# EAGLE design DCDC (EAGLE 7.5.0)
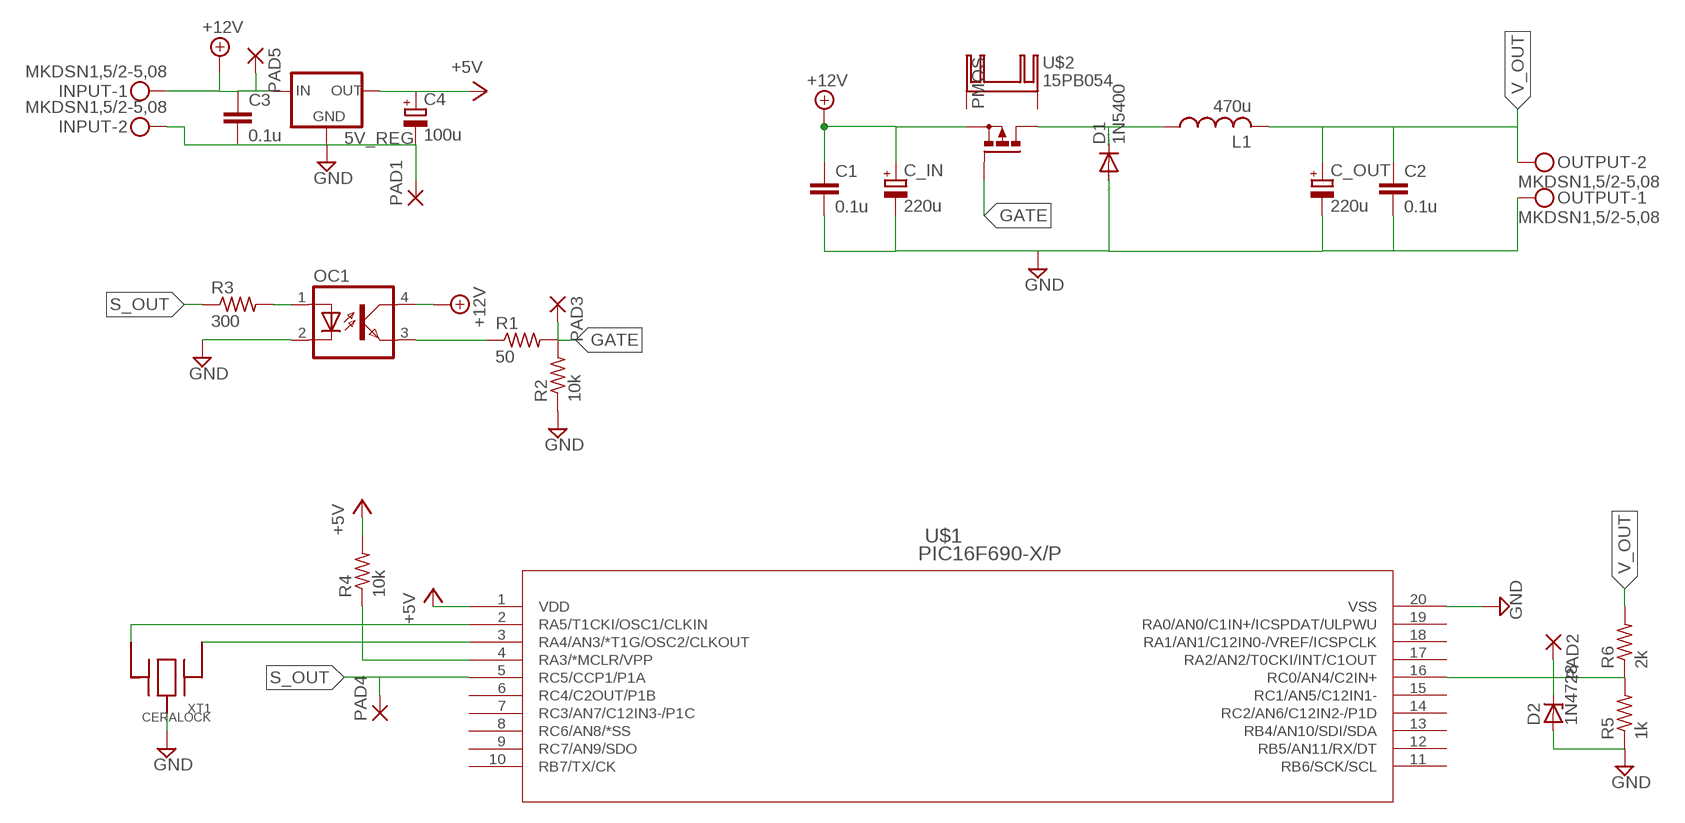
[diagram p0: schematic, sheet 1]

## Parts
5V_REG  78XXS  [78XXS]
C1  0.1u  C-EU050-024X044  [C050-024X044]
C2  0.1u  C-EU050-024X044  [C050-024X044]
C3  0.1u  C-EU050-024X044  [C050-024X044]
C4  100u  CPOL-EUE2,5-6E  [E2,5-6E]
C_IN  220u  CPOL-EUE3.5-8  [E3,5-8]
C_OUT  220u  CPOL-EUE3.5-8  [E3,5-8]
D1  1N5400  [DO201-15]
D2  1N4728  [DO41Z10]
INPUT  MKDSN1,5/2-5,08  [MKDSN1,5/2-5,08]
L1  470u  L-US  [TCV-471M-9A-8026]
OC1  PC817  [DIL04]
OUTPUT  MKDSN1,5/2-5,08  [MKDSN1,5/2-5,08]
PAD1  2,54/0,8  [2,54/0,8]
PAD2  2,54/0,8  [2,54/0,8]
PAD3  2,54/0,8  [2,54/0,8]
PAD4  2,54/0,8  [2,54/0,8]
PAD5  2,54/0,8  [2,54/0,8]
PMOS  PMOSFET_PTO220BV  [TO220BV]
R1  50  R-US_0207/7  [0207/7]
R2  10k  R-US_0207/7  [0207/7]
R3  300  R-US_0207/7  [0207/7]
R4  10k  R-US_0207/7  [0207/7]
R5  1k  R-US_0207/10  [0207/10]
R6  2k  R-US_0207/7  [0207/7]
U$1  PIC16F690-X/P  [PDIP20_300MC]
U$2  15PB054  [15PB054]
XT1  CERALOCK  [CERALOCK]

## Nets
+5V: 5V_REG.OUT C4.+ R4.2 U$1.1(VDD)
+12V: 5V_REG.IN C1.1 C3.1 C_IN.+ INPUT.1 OC1.4(COL) PAD5.1(P) PMOS.S
GATE: PAD3.1(P) PMOS.G R1.2 R2.2
GND: 5V_REG.GND C1.2 C2.2 C3.2 C4.- C_IN.- C_OUT.- D1.A D2.A INPUT.2 OC1.2(C) OUTPUT.1 PAD1.1(P) R2.1 R5.1 U$1.20(VSS) XT1.P$2
N$2: OC1.3(EMIT) R1.1
N$3: OC1.1(A) R3.2
N$4: U$1.2(RA5/T1CKI/OSC1/CLKIN) XT1.P$3
N$5: U$1.3(RA4/AN3/*T1G/OSC2/CLKOUT) XT1.P$1
N$6: R4.1 U$1.4(RA3/*MCLR/VPP)
N$7: D1.C L1.P$1 PMOS.D
S_OUT: PAD4.1(P) R3.1 U$1.5(RC5/CCP1/P1A)
V_IN: D2.C PAD2.1(P) R5.2 R6.1 U$1.16(RC0/AN4/C2IN+)
V_OUT: C2.1 C_OUT.+ L1.P$2 OUTPUT.2 R6.2
Unconnected: U$1.6(RC4/C2OUT/P1B) U$1.7(RC3/AN7/C12IN3-/P1C) U$1.8(RC6/AN8/*SS) U$1.9(RC7/AN9/SDO) U$1.10(RB7/TX/CK) U$1.11(RB6/SCK/SCL) U$1.12(RB5/AN11/RX/DT) U$1.13(RB4/AN10/SDI/SDA) U$1.14(RC2/AN6/C12IN2-/P1D) U$1.15(RC1/AN5/C12IN1-) U$1.17(RA2/AN2/T0CKI/INT/C1OUT) U$1.18(RA1/AN1/C12IN0-/VREF/ICSPCLK) U$1.19(RA0/AN0/C1IN+/ICSPDAT/ULPWU) U$2.P$1(K) U$2.P$2(K)

## Library data of the parts
5V_REG = v-reg:78XXS: VOLTAGE REGULATOR
C1-C3 = rcl:C-EU: CAPACITOR, European symbol
C4 C_IN C_OUT = rcl:CPOL-EU: POLARIZED CAPACITOR, European symbol
D1 = diode:1N5400: DIODE standard rectifier, 3 A, 50 V (Motorola)
D2 = diode:1N4728: Z DIODE 3.3 V, 1W, 5 percent
INPUT OUTPUT = con-phoenix-508:MKDSN1,5/2-5,08: MKDSN 1,5/ 2-5,08 Printklemme Nennstrom: 13,5 A Nennspannung: 250 V Rastermaß: 5,08 mm Polzahl: 2 Anschlussart: Schraubanschluss Montage: Löten Anschlussrichtung Leiter/Platine: 0 ° Artikelnummer: 1729128 Source: http://eshop.phoenixcontact.com .. 1729128.pdf
L1 = rcl:L-US: INDUCTOR, American symbol
OC1 = photocoupler:PC817: SHARP OPTO COUPLER
PAD1-PAD5 = wirepad:2,54/0,8: THROUGH-HOLE PAD
PMOS = transistor-power:PMOSFET_P: Power MOSFET P-Channel
R1-R6 = rcl:R-US_: RESISTOR, American symbol
U$1 = pic16f690_p:PIC16F690-X/P
U$2 = heatsink:15PB054
XT1 = serolock:CERALOCK

## Board
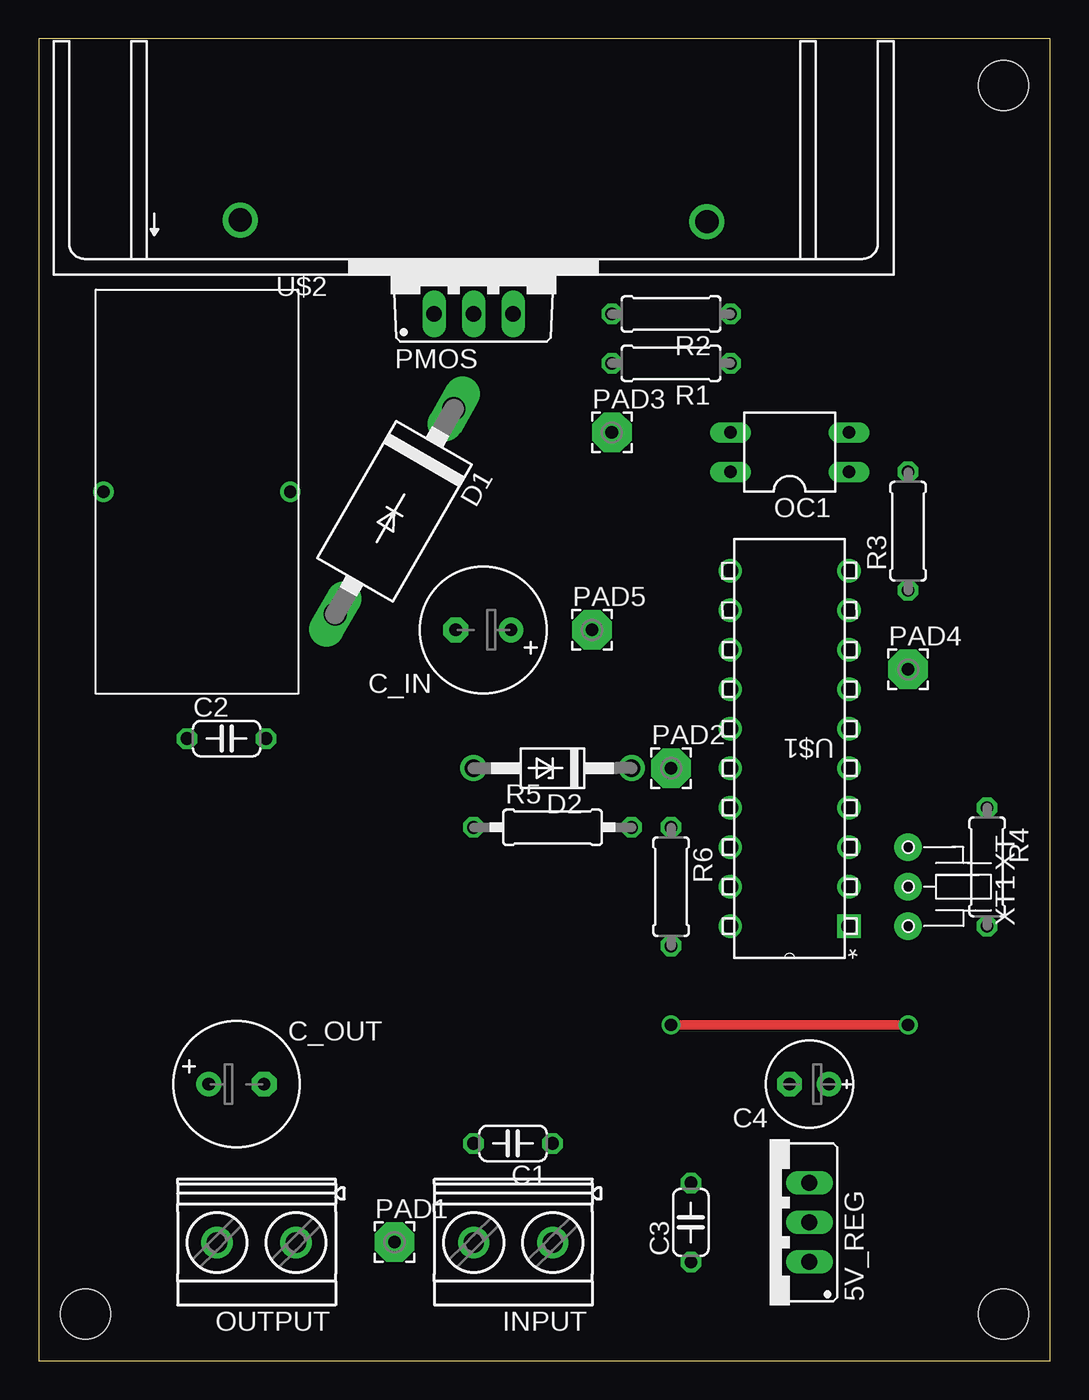
[diagram p1: board, top side]
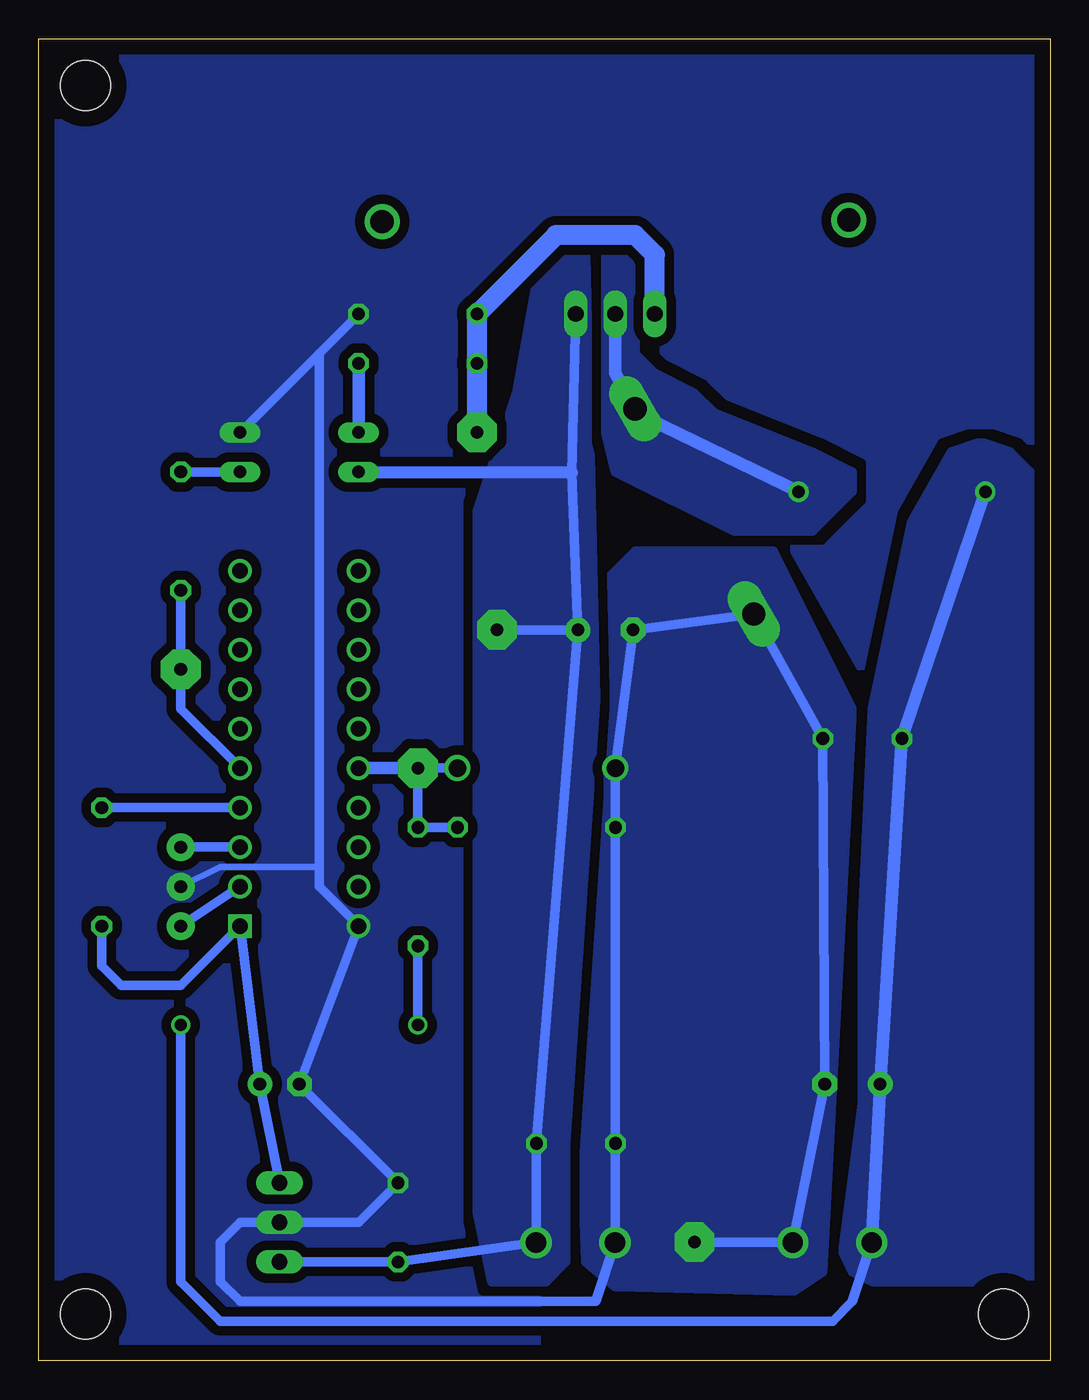
[diagram p2: board, bottom side, seen from below]

Size 65 x 85 mm. Coordinates in mm from the lower left corner, seen from the top.
Outline: 0,0 65,0 65,85 0,85 0,0
Copper layers (1*16): Top 0.035mm / dielectric 1.5mm / Bottom 0.035mm
Design rules "default": minimum track width 10mil, minimum drill 24mil, track to track 8mil, track to pad 8mil, pad to pad 8mil, via to via 8mil, smd to smd 8mil, copper to edge 40mil, drill to drill 8mil, minimum pad ring 10mil, minimum via ring 8mil, stop-mask expansion 4mil, vias tented up to drill 0mil, thermal gap 10mil
Holes 3.2 mm at 62,3 62,82 3,3

### Footprints (pad centres in the part's own frame; a part is rotated, then mirrored left to right if it is on the bottom)
78XXS = drill 1.016 long: GND 0,-2.54; IN -2.54,-2.54; OUT 2.54,-2.54
C050-024X044 = drill 0.813 octagon: 1 -2.54,0; 2 2.54,0
E2,5-6E = drill 0.813 pad 1.575: + -1.27,0 | drill 0.813 pad 1.575 octagon: - 1.27,0
E3,5-8 = drill 0.813 pad 1.6: + -1.778,0 | drill 0.813 pad 1.6 octagon: - 1.778,0
DO201-15 = drill 1.499 long: A 7.62,0; C -7.62,0
DO41Z10 = drill 1.118: A 5.08,0; C -5.08,0
MKDSN1,5/2-5,08 = drill 1.3 pad 2: 1 -2.561,0.025; 2 2.519,0.025
TCV-471M-9A-8026 = drill 0.8: P$1 6,0; P$2 -6,0
DIL04 = drill 0.813 long: 1 -1.27,-3.81; 2 1.27,-3.81; 3 1.27,3.81; 4 -1.27,3.81
2,54/0,8 = drill 0.813 pad 2.54 octagon: 1 0,0
TO220BV = drill 1.016 long: D 0,-2.54; G -2.54,-2.54; S 2.54,-2.54
0207/7 = drill 0.813 octagon: 1 -3.81,0; 2 3.81,0
0207/10 = drill 0.813 octagon: 1 -5.08,0; 2 5.08,0
PDIP20_300MC = drill 0.991 square: 1 -7.62,22.86 | drill 0.991: 2 -7.62,20.32; 3 -7.62,17.78; 4 -7.62,15.24; 5 -7.62,12.7; 6 -7.62,10.16; 7 -7.62,7.62; 8 -7.62,5.08; 9 -7.62,2.54; 10 -7.62,0; 11 0,0; 12 0,2.54; 13 0,5.08; 14 0,7.62; 15 0,10.16; 16 0,12.7; 17 0,15.24; 18 0,17.78; 19 0,20.32; 20 0,22.86
15PB054 = drill 1.5: P$1 -15,3.5; P$2 15,3.4
CERALOCK = drill 0.813 pad 1.778: P$1 -2.54,-3.81; P$2 0,-3.81; P$3 2.54,-3.81

### Placement (x,y rotation side)
5V_REG  46.99,8.89 90 top
C1  30.48,13.97 180 top
C2  12.06,40.01 0 top
C3  41.91,8.89 90 top
C4  49.53,17.78 180 top
C_IN  28.57,46.99 180 top
C_OUT  12.7,17.78 0 top
D1  22.86,54.61 240 top
D2  33.02,38.1 180 top
INPUT  30.48,7.62 180 top
L1  10.16,55.88 0 top
OC1  48.26,58.42 90 top
OUTPUT  13.97,7.62 180 top
PAD1  22.86,7.62 0 top
PAD2  40.64,38.1 0 top
PAD3  36.83,59.69 0 top
PAD4  55.88,44.45 0 top
PAD5  35.56,46.99 0 top
PMOS  27.94,69.85 0 top
R1  40.64,64.14 180 top
R2  40.64,67.31 180 top
R3  55.88,53.34 90 top
R4  60.96,31.75 270 top
R5  33.02,34.29 0 top
R6  40.64,30.48 270 top
U$1  44.45,50.8 180 top
U$2  27.94,69.85 0 top
XT1  59.69,30.48 270 top

### Tracks (layer width: path | path; a pad name or v marks a point on that pad's centre or on a via)
+5V
  Bottom 0.61: 5V_REG.OUT C4.+ U$1.1 55.88,24.13 59.69,24.13 60.96,25.4 R4.2
+12V
  Bottom 0.61: 5V_REG.IN C3.1 INPUT.1 C1.1 C_IN.+ | C_IN.+ 30.73,57.12 PMOS.S | C_IN.+ PAD5.1
  Bottom 0.813: OC1.4 30.73,57.12
  pour Bottom (isolate 0.61, rank 2, no thermals): 29.84,71.12 29.21,42.55 31.11,13.97 31.11,6.35 32.38,5.08 35.88,5.08 36.83,9.53 36.83,54.61 34.29,62.23 33.02,69.22 31.75,71.12
GATE
  Bottom 1.27: PAD3.1 R1.2 R2.2 31.75,72.39 26.67,72.39 25.4,71.12 PMOS.G
GND
  Bottom 0.406: XT1.P$2 53.34,31.75 46.99,31.75
  Bottom 0.61: PAD1.1 OUTPUT.1 C_OUT.- C2.2 D1.A C_IN.- D2.A R5.1 C1.2 INPUT.2 29.21,3.81 52.07,3.81 53.34,5.08 53.34,7.62 52.07,8.89 5V_REG.GND 44.45,8.89 C3.2 C4.- U$1.20 46.99,30.48 46.99,31.75 46.99,64.77 | 46.99,64.77 R2.1 | 46.99,64.77 OC1.2
  pour Bottom (isolate 0.61, rank 3, no thermals): 14.61,5.71 12.7,41.91 17.78,52.07 26.67,52.07 28.57,50.16 30.48,23.5 29.84,6.35 27.94,4.76 16.51,4.45
  pour Bottom (isolate 0.61, rank 5, no thermals): 64.77,85.09 0,85.09 0,43.81 12.06,44.45 17.14,53.34 28.57,57.15 33.02,57.15 33.02,0 65.41,0
N$2
  Bottom 0.813: R1.1 OC1.3
N$3
  Bottom 0.61: OC1.1 R3.2
N$4
  Bottom 0.61: U$1.2 XT1.P$3
N$5
  Bottom 0.61: U$1.3 XT1.P$1
N$6
  Bottom 0.61: U$1.4 R4.1
N$7
  Bottom 0.813: PMOS.D 27.94,63.5 26.67,60.96 | 26.67,60.96 L1.P$1 | D1.C 26.67,60.96
  pour Bottom (isolate 0.61, no thermals): 28.57,71.12 28.57,59.69 27.94,57.15 20.32,53.34 15.24,53.34 12.7,55.88 12.7,57.15 15.24,58.42 21.59,60.96 22.86,62.23 25.4,63.5 26.67,64.77 26.67,69.85 27.3,71.12
S_OUT
  Bottom 0.61: U$1.5 55.88,41.91 PAD4.1 R3.1
V_IN
  Bottom 0.61: R5.2 R6.1 PAD2.1 D2.C
  Bottom 0.813: PAD2.1 U$1.16
V_OUT  (via drill 0.8)
  Top 0.61: v55.88,21.59 v40.64,21.59
  Bottom 0.61: OUTPUT.2 12.7,3.81 13.97,2.54 53.34,2.54 55.88,5.08 v55.88,21.59 | v40.64,21.59 R6.2
  Bottom 0.813: L1.P$2 C2.1 C_OUT.+ OUTPUT.2
  pour Bottom (isolate 0.61, rank 2, no thermals): 1.27,57.15 2.54,58.42 4.45,59.05 6.35,58.42 8.89,53.98 11.43,41.91 12.06,27.94 12.06,16.51 13.34,6.99 12.7,5.71 11.43,5.08 0.64,5.08 0,54.61